# EAGLE design polulu (EAGLE 9.5.2)
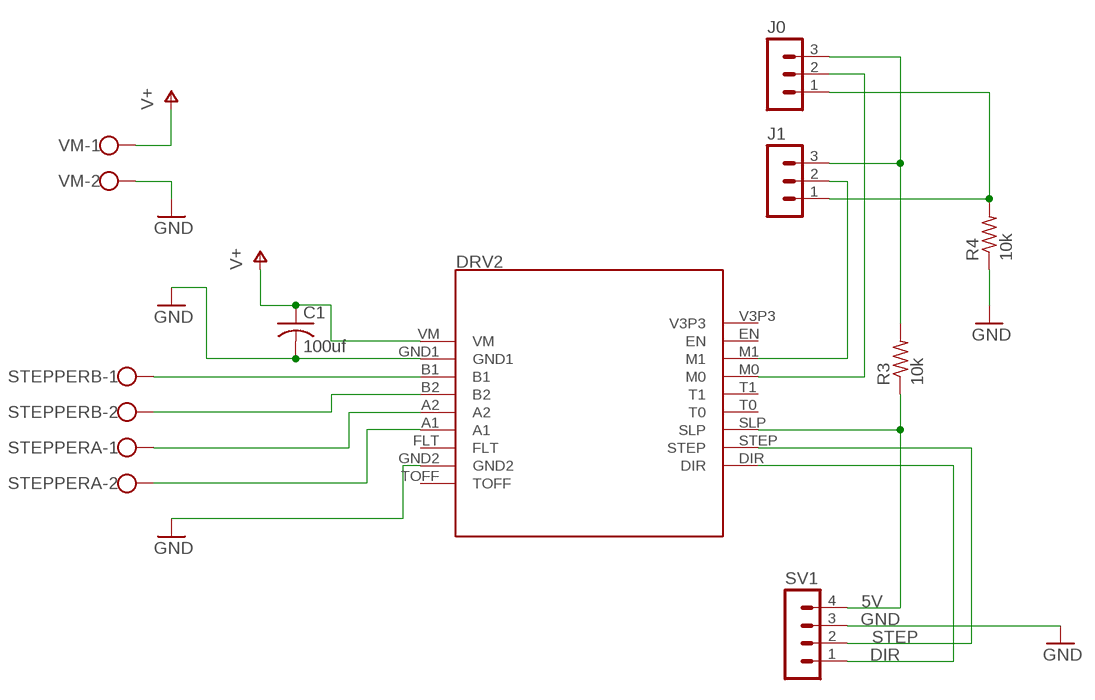
[diagram p0: schematic, sheet 1]

## Parts
C1  100uf  C-US025-024X044  [C025-024X044]
DRV2  DRV8880  [DRV8880]
J0  MA03-1  [MA03-1]
J1  MA03-1  [MA03-1]
R3  10k  R-US_0204/7  [0204/7]
R4  10k  R-US_0204/7  [0204/7]
STEPPERA  W237-102  [W237-102]
STEPPERB  W237-102  [W237-102]
SV1  MA04-1  [MA04-1]
VM  W237-102  [W237-102]

## Nets
5V: DRV2.SLP R3.1 SV1.4
DIR: DRV2.DIR SV1.1
GND: C1.2 DRV2.GND1 DRV2.GND2 R4.1 SV1.3 VM.2
N$2: DRV2.A2 STEPPERA.1
N$6: DRV2.A1 STEPPERA.2
N$7: DRV2.M1 J1.2
N$8: DRV2.M0 J0.2
N$9: J0.3 J1.3 R3.2
N$10: J0.1 J1.1 R4.2
STEP: DRV2.STEP SV1.2
STEPPERB1: DRV2.B1 STEPPERB.1
STEPPERB2: DRV2.B2 STEPPERB.2
V+: C1.1 DRV2.VM VM.1
Unconnected: DRV2.EN DRV2.FLT DRV2.T0 DRV2.T1 DRV2.TOFF DRV2.V3P3

## Library data of the parts
C1 = rcl:C-US: CAPACITOR, American symbol; SPICEPREFIX: C
DRV2 = polulu:DRV8880
J0 J1 = con-lstb:MA03-1: PIN HEADER; OC_FARNELL: unknown; OC_NEWARK: unknown
R3 R4 = rcl:R-US_: RESISTOR, American symbol; SPICEPREFIX: R
STEPPERA STEPPERB VM = con-wago-500:W237-102: WAGO SCREW CLAMP; MPN: 237-102; OC_FARNELL: unknown; OC_NEWARK: 70K9898
SV1 = con-lstb:MA04-1: PIN HEADER; OC_FARNELL: unknown; OC_NEWARK: unknown

## Net classes
0 default: width 0.254 mm, clearance 0.305 mm

## Board
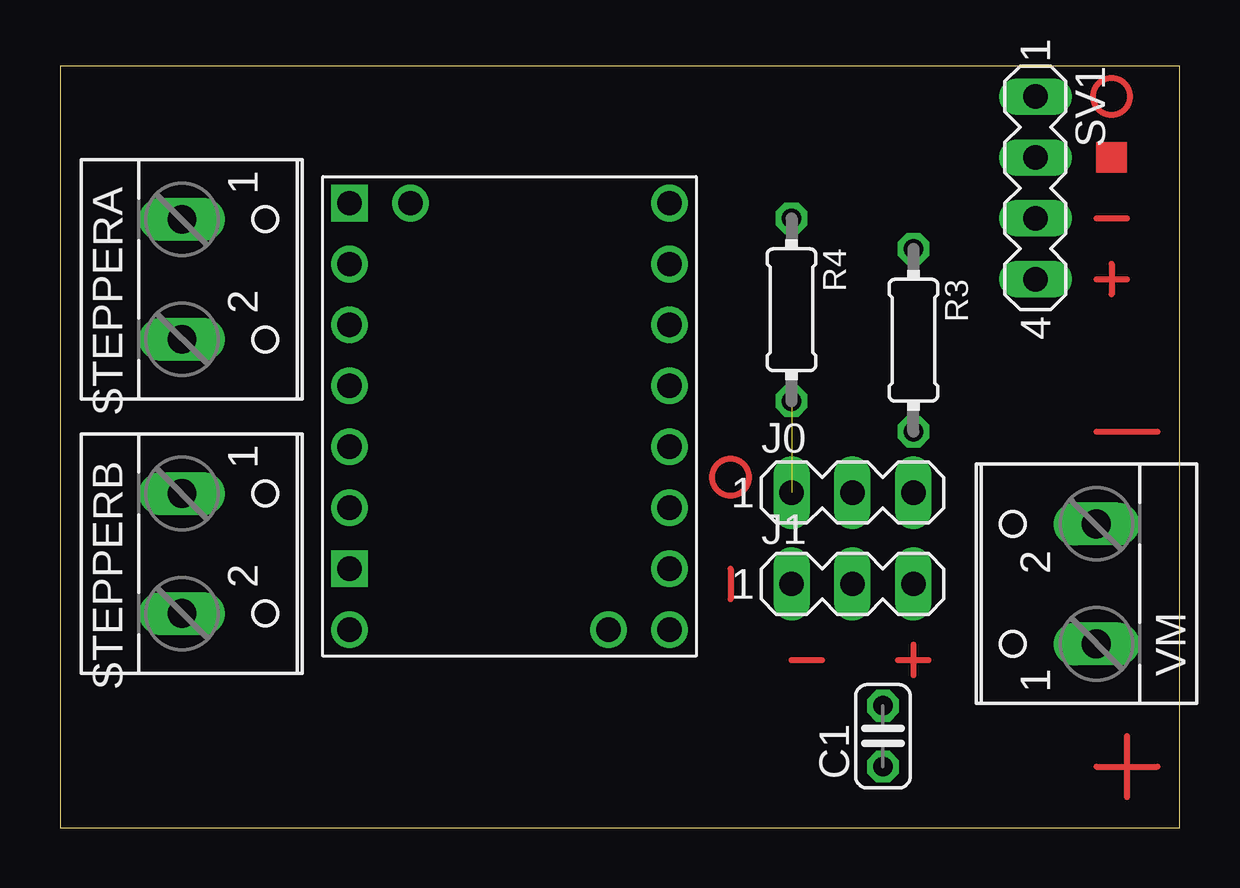
[diagram p1: board, top side]
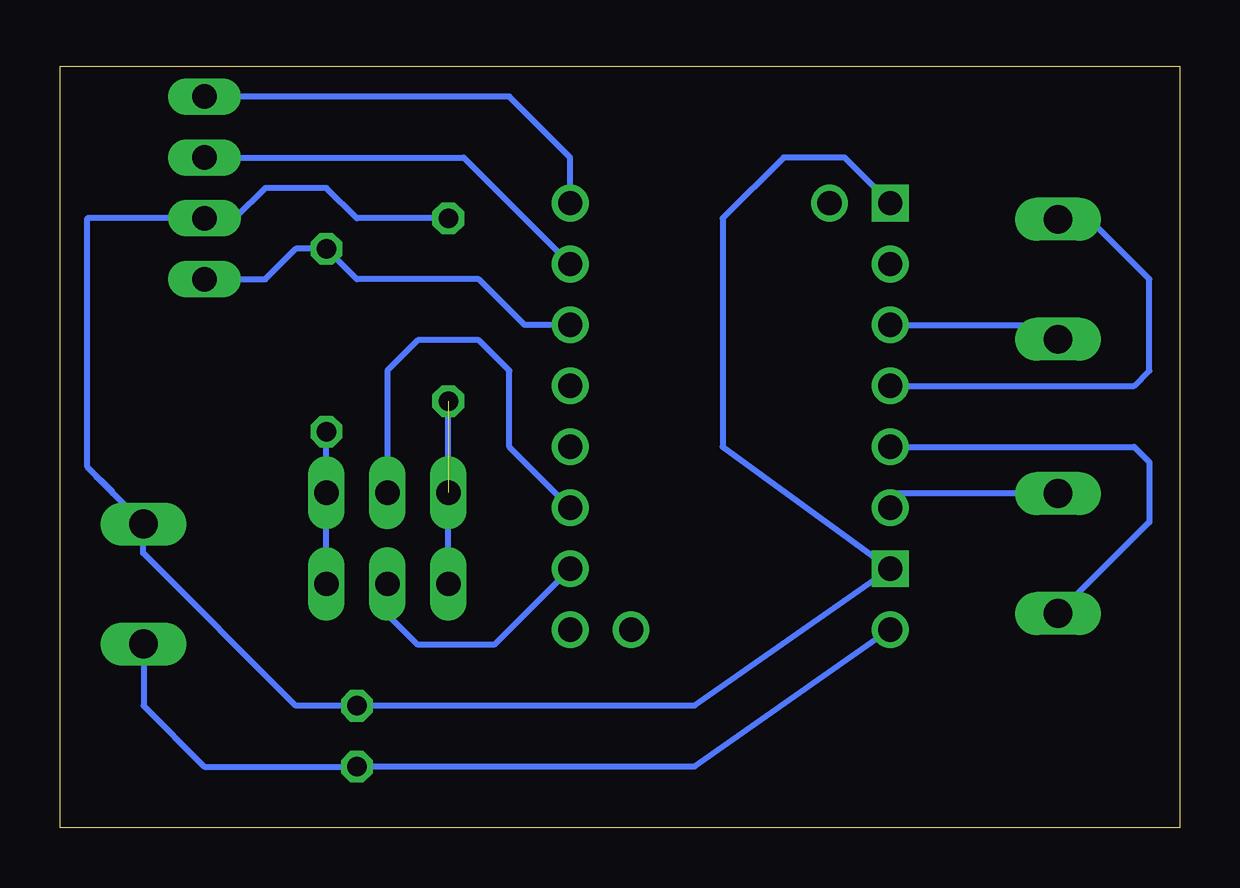
[diagram p2: board, bottom side, seen from below]

Size 46.66 x 31.74 mm. Coordinates in mm from the lower left corner, seen from the top.
Outline: 0,0 46.66,0 46.66,31.74 0,31.74 0,0
Copper layers (1*16): Top 0.035mm / dielectric 1.5mm / Bottom 0.035mm
Design rules "default": minimum track width 6mil, minimum drill 0.35mm, track to track 6mil, track to pad 6mil, pad to pad 6mil, via to via 6mil, smd to smd 6mil, copper to edge 40mil, drill to drill 6mil, minimum pad ring 10mil, minimum via ring 8mil, stop-mask expansion 4mil, vias tented up to drill 0mil, thermal gap 10mil

### Footprints (pad centres in the part's own frame; a part is rotated, then mirrored left to right if it is on the bottom)
C025-024X044 = drill 0.813 octagon: 1 -1.27,0; 2 1.27,0
DRV8880 = drill 1.016: A1 6.985,-4.445; A2 6.985,-1.905; B1 6.985,3.175; B2 6.985,0.635; DIR -6.35,-9.525; EN -6.35,8.255; FLT 6.985,-6.985; M0 -6.35,3.175; M1 -6.35,5.715; SLP -6.35,-4.445; STEP -6.35,-6.985; T0 -6.35,-1.905; T1 -6.35,0.635; TOFF 4.445,-9.525; V3P3 -3.81,8.255; VM 6.985,8.255 | drill 1.016 square: GND1 6.985,5.715; GND2 6.985,-9.525
MA03-1 = drill 1.016 long: 1 -2.54,0; 2 0,0; 3 2.54,0
0204/7 = drill 0.813 octagon: 1 -3.81,0; 2 3.81,0
W237-102 = drill 1.194 long: 1 -2.5,-1.27; 2 2.5,-1.27
MA04-1 = drill 1.016 long: 1 -3.81,0; 2 -1.27,0; 3 1.27,0; 4 3.81,0

### Placement (x,y rotation side)
C1  34.29,3.81 90 top
DRV2  19.05,16.51 180 top
J0  33.02,13.97 0 top
J1  33.02,10.16 0 top
R3  35.56,20.32 270 top
R4  30.48,21.59 270 top
STEPPERA  6.35,22.86 270 top
STEPPERB  6.35,11.43 270 top
SV1  40.64,26.67 270 top
VM  41.91,10.16 90 top

### Tracks (layer width: path | path; a pad name or v marks a point on that pad's centre or on a via)
5V
  Bottom 0.254: SV1.4 38.1,22.86 36.83,24.13 R3.1 34.29,22.86 29.21,22.86 27.3,20.95 DRV2.SLP
DIR
  Bottom 0.254: SV1.1 27.94,30.48 25.4,27.94 DRV2.DIR
GND
  Bottom 0.254: 45.14,14.62 44.47,13.95 | 44.47,13.95 43.2,12.68 | 43.2,12.68 VM.2 | 44.47,13.95 44.47,13.99 45.52,15.04 45.52,25.4 SV1.3 39.37,25.4 38.1,26.67 35.56,26.67 34.29,25.4 R4.1 | DRV2.GND2 13.97,27.94 16.51,27.94 19.05,25.4 19.05,15.88 DRV2.GND1 20.23,5.08 C1.2 36.83,5.08 43.2,11.45 43.2,12.68
N$1
  Top 0.254: 43.18,2.54 45.72,2.54
N$2
  Bottom 0.254: DRV2.A2 1.91,18.41 1.27,19.05 1.27,22.86 3.81,25.4 5.04,25.4 STEPPERA.1
N$3
  Top 0.254: 44.45,3.81 44.45,1.27
N$4
  Top 0.254: 43.18,22.86 44.45,22.86
N$5
  Top 0.254: 43.82,23.5 43.82,22.22
N$6
  Bottom 0.254: STEPPERA.2 5.68,20.95 DRV2.A1
N$7
  Bottom 0.254: J1.2 33.02,8.89 31.75,7.62 28.58,7.62 DRV2.M1
N$8
  Bottom 0.254: DRV2.M0 27.94,15.88 27.94,19.05 29.21,20.32 31.75,20.32 33.02,19.05 J0.2
N$9
  Bottom 0.254: R3.2 J0.3 J1.3
N$10  (1 unrouted)
  Bottom 0.254: J1.1 R4.2
N$11
  Top 0.254: 43.18,16.51 45.72,16.51
N$12
  Top 0.254: 43.18,25.4 44.45,25.4
N$13
  Top 0.254: 27.94,10.79 27.94,9.52
N$14
  Top 0.254: 34.93,6.98 36.2,6.98
N$15
  Top 0.254: 35.56,7.62 35.56,6.35
N$16
  Top 0.254: 30.48,6.98 31.75,6.98
STEP
  Bottom 0.254: SV1.2 29.85,27.94 DRV2.STEP
STEPPERB1
  Bottom 0.254: STEPPERB.1 12.08,13.93 DRV2.B1
STEPPERB2
  Bottom 0.254: STEPPERB.2 1.27,12.74 1.27,15.24 1.91,15.88 DRV2.B2
V+
  Bottom 0.254: DRV2.VM 20.23,2.54 C1.1 40.64,2.54 43.18,5.08 VM.1
(copper drawn outside any net)
  shapes: Top area x1, Top circle x2